# EAGLE schematic Avakai_V02 (EAGLE 7.3.0)
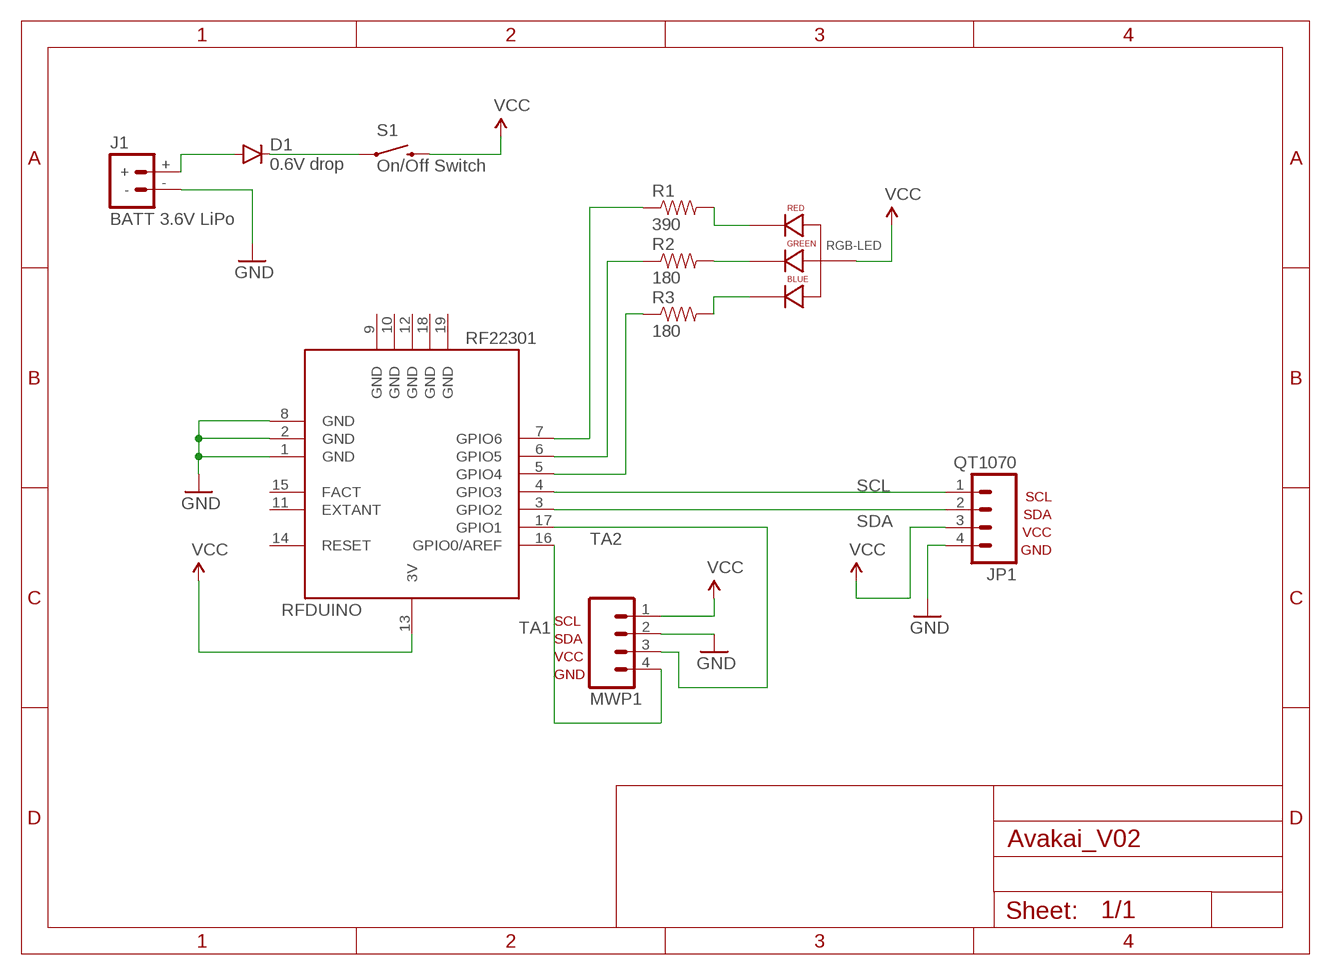
[diagram p0: schematic, sheet 1]

## Parts
D1  0.6V drop  DIODE1N4148  [DIODE-1N4148]
J1  BATT 3.6V LiPo  BATTERY_CONNDEANS  [DEANS]
JP1  QT1070  M04NO_SILK_ALL_ROUND  [1X04_NO_SILK_ALL_ROUND]
MWP1  M04PTH  [1X04]
R1  390  RESISTORPTH-1/4W  [AXIAL-0.4]
R2  180  RESISTORPTH-1/4W  [AXIAL-0.4]
R3  180  RESISTORPTH-1/4W  [AXIAL-0.4]
RFDUINO  RF22301  [RFD22301]
RGB-LED  LED-RGB-CA-THRUCLEAR  [LED-RGB-THRU]
S1  On/Off Switch  SWITCH-MOMENTARY-2SIDE_EZ  [TACTILE-PTH-SIDEEZ]

## Nets
GND: J1.- JP1.4 MWP1.2 RFDUINO.1(GND) RFDUINO.2(GND) RFDUINO.8(GND)
N$2: R1.P$2 RGB-LED.1(RED_CATHODE)
N$3: R2.P$1 RFDUINO.6(GPIO5)
N$4: D1.A J1.+
N$5: R3.P$2 RGB-LED.4(BLUE_CATHODE)
N$6: R2.P$2 RGB-LED.3(GREEN_CATHODE)
N$9: R1.P$1 RFDUINO.7(GPIO6)
N$10: D1.C S1.1
N$12: R3.P$1 RFDUINO.5(GPIO4)
SCL: JP1.1 RFDUINO.4(GPIO3)
SDA: JP1.2 RFDUINO.3(GPIO2)
TA1: MWP1.4 RFDUINO.16(GPIO0/AREF)
TA2: MWP1.3 RFDUINO.17(GPIO1)
VCC: JP1.3 MWP1.1 RFDUINO.13(3V) RGB-LED.2(ANODE) S1.2
Unconnected: RFDUINO.11(EXTANT) RFDUINO.14(RESET) RFDUINO.15(FACT)

## Power pins joined to a net without a drawn wire
GND: RFDUINO.9(GND) RFDUINO.10(GND) RFDUINO.12(GND) RFDUINO.18(GND) RFDUINO.19(GND)

## Library data of the parts
D1 = SparkFun-DiscreteSemi:DIODE: Diode These are standard reverse protection diodes and small signal diodes. SMA package can handle up to about 1A. SOD-323 can handle about 200mA. What the SOD-323 package when ordering, there are some mfgs out there that are 5-pin packages.
J1 = SparkFun-Connectors:BATTERY_CONN: Various footprints for battery connectors
JP1 MWP1 = SparkFun-Connectors:M04: Header 4 Standard 4-pin 0.1" header. Use with straight break away headers (SKU : PRT-00116), right angle break away headers (PRT-00553), swiss pins (PRT-00743), machine pins (PRT-00117), and female headers (PRT-00115). Molex polarized connector foot print use with SKU : PRT-08231 with associated crimp pins and housings. 1MM SMD Version SKU: PRT-10208
R1-R3 = SparkFun-Passives:RESISTOR: Resistor Basic schematic elements and footprints for 0603, 1206, and PTH resistors.
RFDUINO = GeekAmmo:RF22301: RFD22301 RFDuino Bluetooth 4.0 Low Energy BLE RF Module With Built-In ARM Cortex M0 Microconroller Hi performance, professional grade Bluetooth 4.0 Low Energy radio transceiver with built-in ARM Cortex M0 microcontroller that can be programmed using the simple-to-use Arduino IDE using RFduino extensions. Built-in user application microcontroller with ADC, I2C, SPI, UART and GPIO. http://www.rfduino.com/
RGB-LED = SparkFun-LED:LED-RGB-CA-THRU: RGB Through-hole common anode SparkFun store front COM-10821 (diffuse) COM-10820 (clear); PROD_ID: DIO-10631
S1 = SparkFun-Electromechanical:SWITCH-MOMENTARY-2: Various NO switches- pushbuttons, reed, etc